# EAGLE design 1u_debug_breakout (EAGLE 7.6.0)
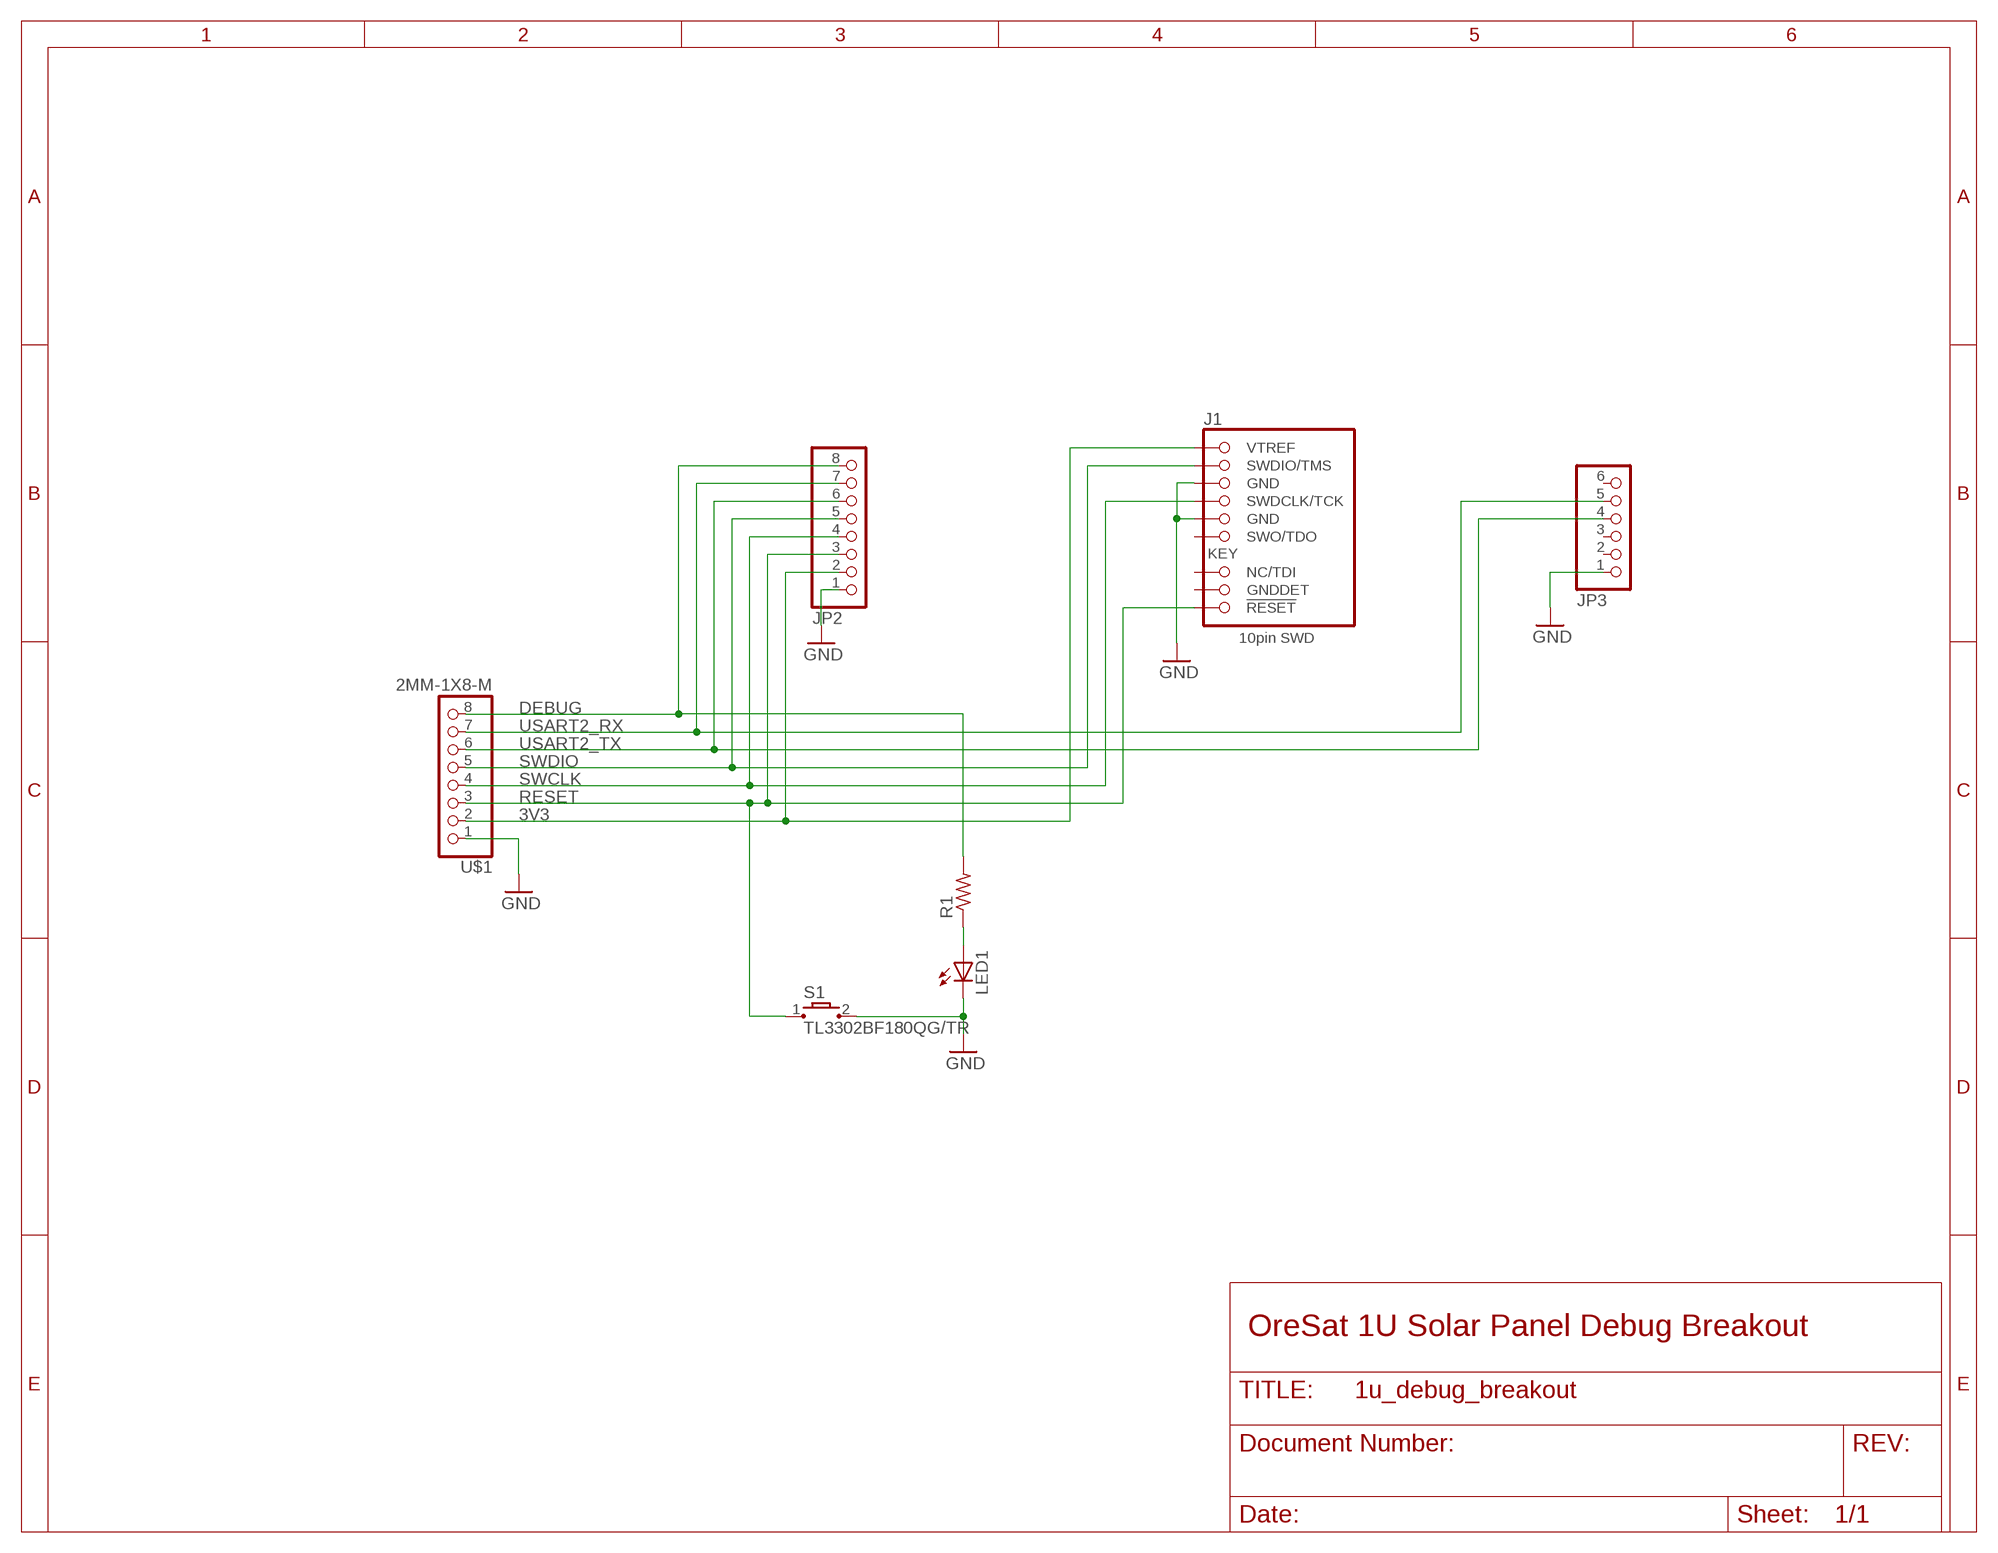
[diagram p0: schematic, sheet 1]

## Parts
J1  1.27MM-SWD-CONNECTOR  [1.27MM_2X5]
JP2  PINHD-1X8  [1X08]
JP3  PINHD-1X6  [1X06]
LED1  LEDCHIPLED_0603  [CHIPLED_0603]
R1  R-US_R0603  [R0603]
S1  TL3302BF180QG/TR  TL3302-G  [TL3302_GULL_WING]
U$1  2MM-1X8-M  [CF-2MM-1X8-PRECIDIP-880]

## Nets
3V3: J1.VTREF JP2.2 U$1.2
DEBUG: JP2.8 R1.2 U$1.8
GND: J1.GND J1.GND@2(GND) JP2.1 JP3.1 LED1.C S1.2 U$1.1
N$1: LED1.A R1.1
RESET: J1.!RESET JP2.3 S1.1 U$1.3
SWCLK: J1.SWDCLK(SWDCLK/TCK) JP2.4 U$1.4
SWDIO: J1.SWDIO(SWDIO/TMS) JP2.5 U$1.5
USART2_RX: JP2.7 JP3.5 U$1.7
USART2_TX: JP2.6 JP3.4 U$1.6
Unconnected: J1.GNDDET J1.NC(NC/TDI) J1.SWO(SWO/TDO) JP3.2 JP3.3 JP3.6

## Notes on the sheet
- OreSat 1U Solar Panel Debug Breakout

## Library data of the parts
J1 = con-swd:1.27MM-SWD-CONNECTOR
JP2 = pinhead:PINHD-1X8: PIN HEADER
JP3 = pinhead:PINHD-1X6: PIN HEADER
LED1 = led:LED: LED OSRAM: - CHIPLED LG R971, LG N971, LY N971, LG Q971, LY Q971, LO R971, LY R971 LH N974, LH R974 LS Q976, LO Q976, LY Q976 LO Q996 - Hyper CHIPLED LW Q18S LB Q993, LB Q99A, LB R99A - SideLED LS A670, LO A670, LY A670, LG A670, LP A670 LB A673, LV A673, LT A673, LW A673 LH A674 LY A675 LS A676, LA A676, LO A676, LY A676, LW A676 LS A679, LY A679, LG A679 - Hyper Micro SIDELED® LS Y876, LA Y876, LO Y876, LY Y876 LT Y87S - SmartLED LW L88C, LW L88S LB L89C, LB L89S, LG L890 LS L89K, LO L89K, LY L89K LS L896, LA L896, LO L896, LY L896 - TOPLED LS T670, LO T670, LY T670, LG T670, LP T670 LSG T670, LSP T670, LSY T670, LOP T670, LYG T670 LG T671, LOG T671, LSG T671 LB T673, LV T673, LT T673, LW T673 LH T674 LS T676, LA T676, LO T676, LY T676, LB T676, LH T676, LSB T676, LW T676 LB T67C, LV T67C, LT T67C, LS T67K, LO T67K, LY T67K, LW E67C LS E67B, LA E67B, LO E67B, LY E67B, LB E67C, LV E67C, LT E67C LW T67C LS T679, LY T679, LG T679 LS T770, LO T770, LY T770, LG T770, LP T770 LB T773, LV T773, LT T773, LW T773 LH T774 LS E675, LA E675, LY E675, LS T675 LS T776, LA T776, LO T776, LY T776, LB T776 LHGB T686 LT T68C, LB T68C - Hyper Mini TOPLED® LB M676 - Mini TOPLED Santana® LG M470 LS M47K, LO M47K, LY M47K Source: http://www.osram.convergy.de LUXEON: - LUMILED® LXK2-PW12-R00, LXK2-PW12-S00, LXK2-PW14-U00, LXK2-PW14-V00 LXK2-PM12-R00, LXK2-PM12-S00, LXK2-PM14-U00 LXK2-PE12-Q00, LXK2-PE12-R00, LXK2-PE12-S00, LXK2-PE14-T00, LXK2-PE14-U00 LXK2-PB12-K00, LXK2-PB12-L00, LXK2-PB12-M00, LXK2-PB14-N00, LXK2-PB14-P00, LXK2-PB14-Q00 LXK2-PR12-L00, LXK2-PR12-M00, LXK2-PR14-Q00, LXK2-PR14-R00 LXK2-PD12-Q00, LXK2-PD12-R00, LXK2-PD12-S00 LXK2-PH12-R00, LXK2-PH12-S00 LXK2-PL12-P00, LXK2-PL12-Q00, LXK2-PL12-R00 Source: www.luxeon.com KINGBRIGHT: KA-3528ASYC Source: www.kingbright.com
R1 = resistor:R-US_: RESISTOR, American symbol
S1 = eswitch-tact:TL3302: E-Switch TL3302 Series Tactile Switch Surface mount button commonly used for reset or general input. 3.5 x 6mm packaged design. -G: Gull wing termination. Parts TL-3302-x-xxxx-x-G -J: J-Lead termination. Parts TL-3302-x-xxxx-x-J Source: http://www.e-switch.com/Portals/0/Series_Pdf/TL3302.pdf Supplier: DigiKey: http://be.digikey.com/scripts/dksearch/dksus.dll?vendor=0&keywords=TL3302
U$1 = 2mm-RA-solar-module-debugging:2MM-1X8-M

## Board
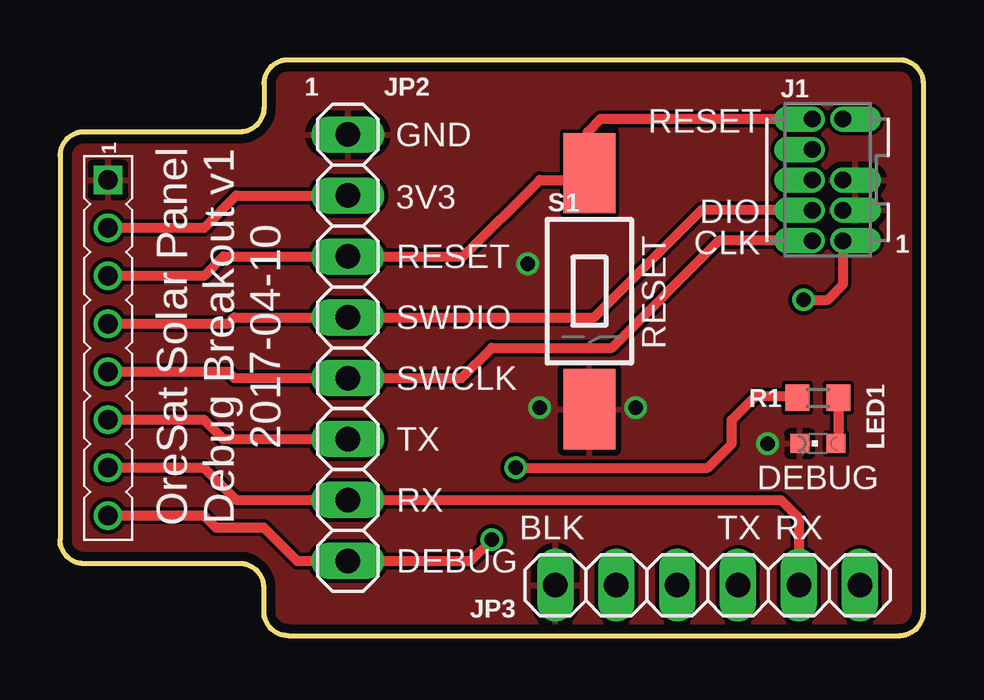
[diagram p1: board, top side]
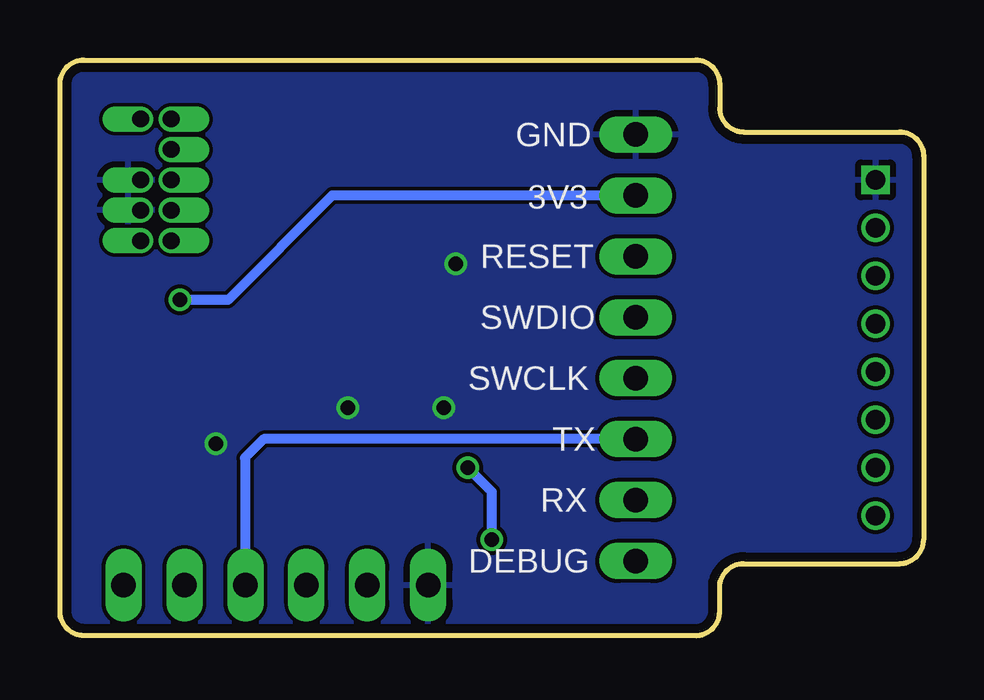
[diagram p2: board, bottom side, seen from below]

Size 36 x 24 mm. Coordinates in mm from the lower left corner, seen from the top.
Outline: 35,0 arc90 36,1 36,23 arc90 35,24 9.5,24 arc90 8.5,23 8.5,22 arc-90 7.5,21 1,21 arc90 0,20 0,4 arc90 1,3 7.5,3 arc-90 8.5,2 8.5,1 arc90 9.5,0 35,0
Copper layers (1*16): Top 0.0356mm / dielectric 1.5011mm / Bottom 0.0356mm
Design rules "OSHPark-2layer": minimum track width 6mil, minimum drill 13mil, track to track 6mil, track to pad 6mil, pad to pad 6mil, via to via 6mil, smd to smd 6mil, copper to edge 15mil, drill to drill 6mil, minimum pad ring 7mil, minimum via ring 7mil, stop-mask expansion 2.5mil, vias tented up to drill 0mil, thermal gap 10mil

### Footprints (pad centres in the part's own frame; a part is rotated, then mirrored left to right if it is on the bottom)
1.27MM_2X5 = drill 0.7 pad 1.016 offset: !RESET 0.635,-2.54; GND -0.635,1.27; GND@2 -0.635,0; GNDDET -0.635,-2.54; NC 0.635,-1.27; SWDCLK 0.635,1.27; SWDIO 0.635,2.54; SWO 0.635,0; VTREF -0.635,2.54
1X08 = drill 1.016 long: 1 -8.89,0; 2 -6.35,0; 3 -3.81,0; 4 -1.27,0; 5 1.27,0; 6 3.81,0; 7 6.35,0; 8 8.89,0
1X06 = drill 1.016 long: 1 -6.35,0; 2 -3.81,0; 3 -1.27,0; 4 1.27,0; 5 3.81,0; 6 6.35,0
CHIPLED_0603 = smd 0.8 x 0.8: A 0,-0.75; C 0,0.75
R0603 = smd 1 x 1.1: 1 -0.85,0; 2 0.85,0
TL3302_GULL_WING = smd 3.35 x 2.16: 1 -4.925,0; 2 4.925,0
CF-2MM-1X8-PRECIDIP-880 = drill 0.8 square: 1 0,0 | drill 0.8: 2 2,0; 3 4,0; 4 6,0; 5 8,0; 6 10,0; 7 12,0; 8 14,0

### Placement (x,y rotation side)
J1  32,19 180 top
JP2  12,12 270 top
JP3  27,2.1 0 top
LED1  31.59,8.01 90 top
R1  31.59,9.91 180 top
S1  22.07,14.35 270 top
U$1  2,19 270 top

### Tracks (layer width: path | path; a pad name or v marks a point on that pad's centre or on a via)
3V3  (via drill 0.6)
  Top 0.406: U$1.2 6,17 7.35,18.35 JP2.2 | v31,14 32,14 32.63,14.63 J1.VTREF
  Bottom 0.406: JP2.2 24.65,18.35 29,14 v31,14
DEBUG  (via drill 0.6)
  Top 0.406: U$1.8 6,5 6.5,4.5 8.5,4.5 9.89,3.11 JP2.8 17.11,3.11 v18,4 | v19,7 27,7 28,8 28,9 29,10 30.66,10 R1.2
  Bottom 0.406: v18,4 18,6 v19,7
GND  (via drill 0.6)
  other vias: 29.5,8 24,9.5 20,9.5 19.5,15.5
  pour Top: 8,23.5 7,23.5 arc90 6.5,23 6.5,22 arc-90 5,20.5 1,20.5 arc90 0.5,20 0.5,4 arc90 1,3.5 5,3.5 arc-90 6.5,2 6.5,1 arc90 7,0.5 35,0.5 arc90 35.5,1 35.5,23 arc90 35,23.5
  pour Bottom: 8,23.5 7,23.5 arc90 6.5,23 6.5,22 arc-90 5,20.5 1,20.5 arc90 0.5,20 0.5,4 arc90 1,3.5 5,3.5 arc-90 6.5,2 6.5,1 arc90 7,0.5 35,0.5 arc90 35.5,1 35.5,23 arc90 35,23.5
N$1
  Top 0.406: R1.1 32.45,8.1 LED1.A
RESET
  Top 0.406: 22.23,19.44 S1.1 | U$1.3 6,15 6.81,15.81 JP2.3 16.81,15.81 20,19 21.79,19 S1.1 | J1.!RESET 22.54,21.54 22,21 22,19.35 S1.1
SWCLK
  Top 0.406: U$1.4 7,13 7.27,13.27 JP2.4 22.27,13.27 26.73,17.73 J1.SWDCLK
SWDIO
  Top 0.406: U$1.5 7,11 7.27,10.73 JP2.5 16.73,10.73 18,12 23,12 27.46,16.46 J1.SWDIO
USART2_RX
  Top 0.406: U$1.7 6,7 7.35,5.65 JP2.7 30.05,5.65 30.8,4.9 JP3.5 30.8,2.01
USART2_TX
  Top 0.406: U$1.6 6,9 6.81,8.19 JP2.6
  Bottom 0.406: JP2.6 27.51,8.19 28.3,7.4 28.27,7.37 JP3.4

### Text on the board
tPlace: 1 | GND | RESET | 3V3 | DIO | RESET | CLK | RESET | SWDIO | OreSat Solar Panel / Debug Breakout v1 / 2017-04-10 | SWCLK | TX | DEBUG | RX | BLK | TX | RX | DEBUG
bPlace: GND | 3V3 | RESET | SWDIO | SWCLK | TX | RX | DEBUG